# EAGLE design 002 (EAGLE 7.6.0)
MAPLE-CUx Large Version
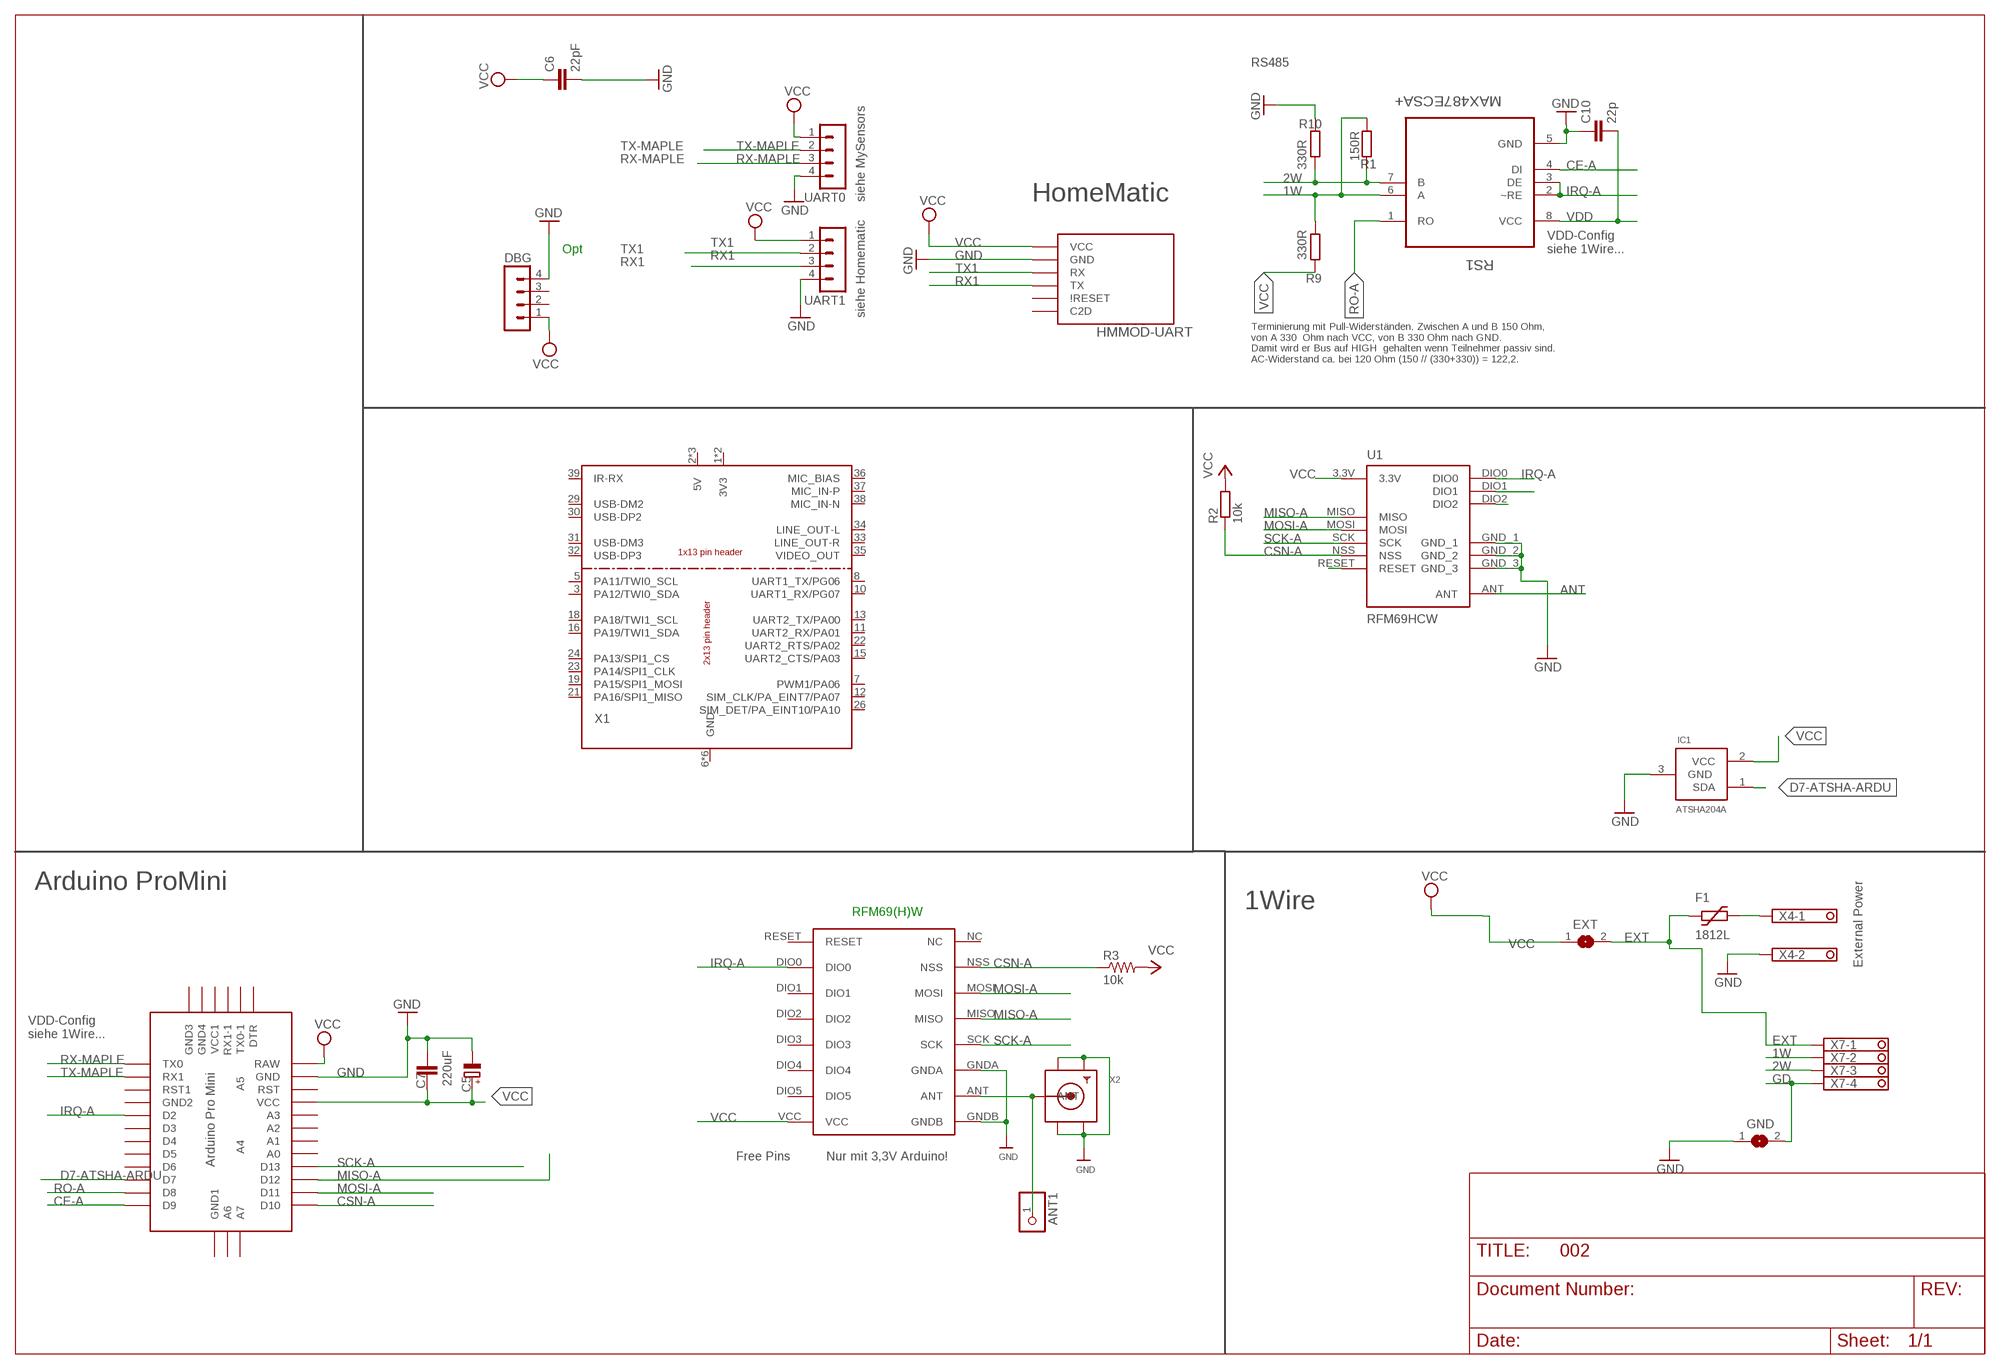
[diagram p0: schematic, sheet 1]

## Parts
ANT1  PINHD-1X1  [1X01]
C5  220uF  CPOL-EUE5-8.5  [E5-8,5]
C6  22pF  C-EUC0805  [C0805]
C7  C-EUC1812  [C1812]
C10  22p  C-EUC0805  [C0805]
DBG  MA04-1  [MA04-1]
EXT  SJ  [SJ]
F1  1812L  [1812L]
GND  SJ  [SJ]
HMMOD-UART  HM-MOD-UARTDIL  [HM-MOD-UART-DIL]
IC1  ATSHA204A  [SOT23]
R1  150R  R-EU_R0805  [R0805]
R2  10k  R-EU_M0805  [M0805]
R3  10k  RESISTOR0805-RES  [0805]
R9  330R  R-EU_R0805  [R0805]
R10  330R  R-EU_R0805  [R0805]
RFM69W  RFM69HW  [RFM]
RS1  MAX487ECSA+  [SOIC127P600X175-8N]
U1  RFM69HCW  [RFM69HCW-XXXS2]
U$2  ABK-PRO-MINI  [ABK-PRO-MINI]
UART0  MA04-1  [MA04-1]
UART1  MA04-1  [MA04-1]
X1  OPI-ZERO-XHAT  [OPI0HAT]
X2  SMACONNECTOR_EDGE  [SMA_EDGELAUNCH]
X4  1751248  [1751248]
X7  1751264  [1751264]

## Nets
1W: R1.1 R9.2 RS1.6(A) X7.2
2W: R1.2 R10.1 RS1.7(B) X7.3
ANT: ANT1.1 RFM69W.ANT U1.ANT X2.P(ANT)
CE-A: RS1.4(DI) U$2.D9
CSN-A: R2.1 R3.1 RFM69W.NSS U1.NSS U$2.D10
D7-ATSHA-ARDU: IC1.1(SDA) U$2.D7
EXT [PWR]: EXT.2 F1.P$1 X7.1
GD [PWR]: GND.2 X7.4
GND [PWR]: C5.- C6.2 C7.1 C10.1 DBG.4 GND.1 HMMOD-UART.2(GND) IC1.3(GND) R10.2 RFM69W.GNDA RFM69W.GNDB RS1.5(GND) U1.GND_1 U1.GND_2 U1.GND_3 U$2.GND UART0.4 UART1.4 X2.GND@1(GND4) X2.GND@2(GND3) X2.GND@3(GND2) X2.GND@4(GND1) X4.2
IRQ-A: RFM69W.DIO0 RS1.2(~RE) RS1.3(DE) U1.DIO0 U$2.D2
MISO-A: RFM69W.MISO U1.MISO U$2.D12
MOSI-A: RFM69W.MOSI U1.MOSI U$2.D11
N$2: U1.RESET
N$14: U1.DIO2
N$15: U1.DIO1
N$45 [PWR]: F1.P$2 X4.1
RO-A: RS1.1(RO) U$2.D8
RX1: HMMOD-UART.5(TX) UART1.3
RX-MAPLE: U$2.TX0 UART0.3
SCK-A: RFM69W.SCK U1.SCK U$2.D13
TX1: HMMOD-UART.6(RX) UART1.2
TX-MAPLE: U$2.RX1 UART0.2
VCC [PWR]: C5.+ C6.1 C7.2 DBG.1 EXT.1 HMMOD-UART.1(VCC) IC1.2(VCC) R2.2 R3.2 R9.1 RFM69W.VCC U1.3.3V U$2.RAW U$2.VCC UART0.1 UART1.1
VDD [PWR]: C10.2 RS1.8(VCC)
Unconnected: DBG.2 DBG.3 HMMOD-UART.3(C2D) HMMOD-UART.4(\!RESET) RFM69W.DIO1 RFM69W.DIO2 RFM69W.DIO3 RFM69W.DIO4 RFM69W.DIO5 RFM69W.NC RFM69W.RESET U$2.A0 U$2.A1 U$2.A2 U$2.A3 U$2.A4 U$2.A5 U$2.A6 U$2.A7 U$2.D3 U$2.D4 U$2.D5 U$2.D6 U$2.DTR U$2.GND1(GND2) U$2.GND2(GND3) U$2.GND3(GND4) U$2.GND4(GND1) U$2.RST U$2.RST1 U$2.RX1-1 U$2.TX0-1 U$2.VCC1 X1.3(PA12/TWI0_SDA) X1.5(PA11/TWI0_SCL) X1.7(PWM1/PA06) X1.8(UART1_TX/PG06) X1.10(UART1_RX/PG07) X1.11(UART2_RX/PA01) X1.12(SIM_CLK/PA_EINT7/PA07) X1.13(UART2_TX/PA00) X1.15(UART2_CTS/PA03) X1.16(PA19/TWI1_SDA) X1.18(PA18/TWI1_SCL) X1.19(PA15/SPI1_MOSI) X1.21(PA16/SPI1_MISO) X1.22(UART2_RTS/PA02) X1.23(PA14/SPI1_CLK) X1.24(PA13/SPI1_CS) X1.26(SIM_DET/PA_EINT10/PA10) X1.29(USB-DM2) X1.30(USB-DP2) X1.31(USB-DM3) X1.32(USB-DP3) X1.33(LINE_OUT-R) X1.34(LINE_OUT-L) X1.35(VIDEO_OUT) X1.36(MIC_BIAS) X1.37(MIC_IN-P) X1.38(MIC_IN-N) X1.39(IR-RX)

## Notes on the sheet
- RS485
- siehe MySensors | HomeMatic
- Opt
- VDD-Config
  siehe 1Wire...
- siehe Homematic
- Terminierung mit Pull-Widerständen. Zwischen A und B 150 Ohm,
  von A 330  Ohm nach VCC, von B 330 Ohm nach GND. 
  Damit wird er Bus auf HIGH  gehalten wenn Teilnehmer passiv sind.
  AC-Widerstand ca. bei 120 Ohm (150 // (330+330)) = 122,2.
- Arduino ProMini
- 1Wire
- RFM69(H)W
- External Power
- VDD-Config
  siehe 1Wire...
- Free Pins | Nur mit 3,3V Arduino!

## Power pins joined to a net without a drawn wire
3V3: X1.1(3V3) X1.17(3V3)
5V: X1.2(5V) X1.4(5V) X1.27(5V)
GND: X1.6(GND) X1.9(GND) X1.14(GND) X1.20(GND) X1.25(GND) X1.28(GND)

## Library data of the parts
ANT1 = pinhead:PINHD-1X1: PIN HEADER
C5 = rcl:CPOL-EU: POLARIZED CAPACITOR, European symbol
C6 C7 C10 = rcl:C-EU: CAPACITOR, European symbol
DBG UART0 UART1 = con-lstb:MA04-1: PIN HEADER; OC_FARNELL: unknown; OC_NEWARK: unknown
EXT GND = jumper:SJ: SMD solder JUMPER
F1 = ptc-littlefuse:1812L
HMMOD-UART = wireless:HM-MOD-UART: eQ3 HM-MOD-UART-AW-SH2 wireless module for 868 MHz. DIL version for mounting with pin header (antenna upwards) and SMD variant available (antenna downwards).
IC1 = Sensor:ATSHA204A
R1 R2 R9 R10 = rcl:R-EU_: RESISTOR, European symbol
R3 = doug:RESISTOR: Resistor Basic schematic elements and footprints for 0603, 1206, and PTH resistors.
RFM69W = hoperf:RFM69HW
RS1 = Maxim_By_element14_Batch_1:MAX487ECSA+: Low-Power, Slew-Rate-Limited RS-485/RS-422 Transceivers; MPN: MAX487ECSA+; OC_FARNELL: 9724532; OC_NEWARK: 68K4803; PACKAGE: SOIC-8; SUPPLIER: Maxim
U1 = doug:RFM69H
U$2 = Arduino-clone:ABK-PRO-MINI: ABK Pro-Mini Arduino Clone
X1 = OrangePi0:OPI-ZERO-X
X2 = adafruit:SMACONNECTOR: SMA Connector 90° DIP SMA Connector, 50 Ohm (4UConnector: 07259)
X4 = con-phoenix-350:1751248: MKDS 1/ 2-3,5 Printklemme Nennstrom: 10 A Bemessungsspannung: 160 V Raster: 3,5 mm Polzahl: 2 Montageart: Löten Anschlussart: Schraubanschluss Anschlussrichtung vom Leiter zur Platine: 0° Source: http://eshop.phoenixcontact.com .. 1751248.pdf; OC_FARNELL: unknown; OC_NEWARK: unknown
X7 = con-phoenix-350:1751264: MKDS 1/ 4-3,5 Printklemme Nennstrom: 10 A Bemessungsspannung: 160 V Raster: 3,5 mm Polzahl: 4 Montageart: Löten Anschlussart: Schraubanschluss Anschlussrichtung vom Leiter zur Platine: 0° Source: http://eshop.phoenixcontact.com .. 1751264.pdf; MPN: 1751264; OC_FARNELL: unknown; OC_NEWARK: 10R0934

## Net classes
0 default: width 0.305 mm
1 PWR: width 0.457 mm

## Board
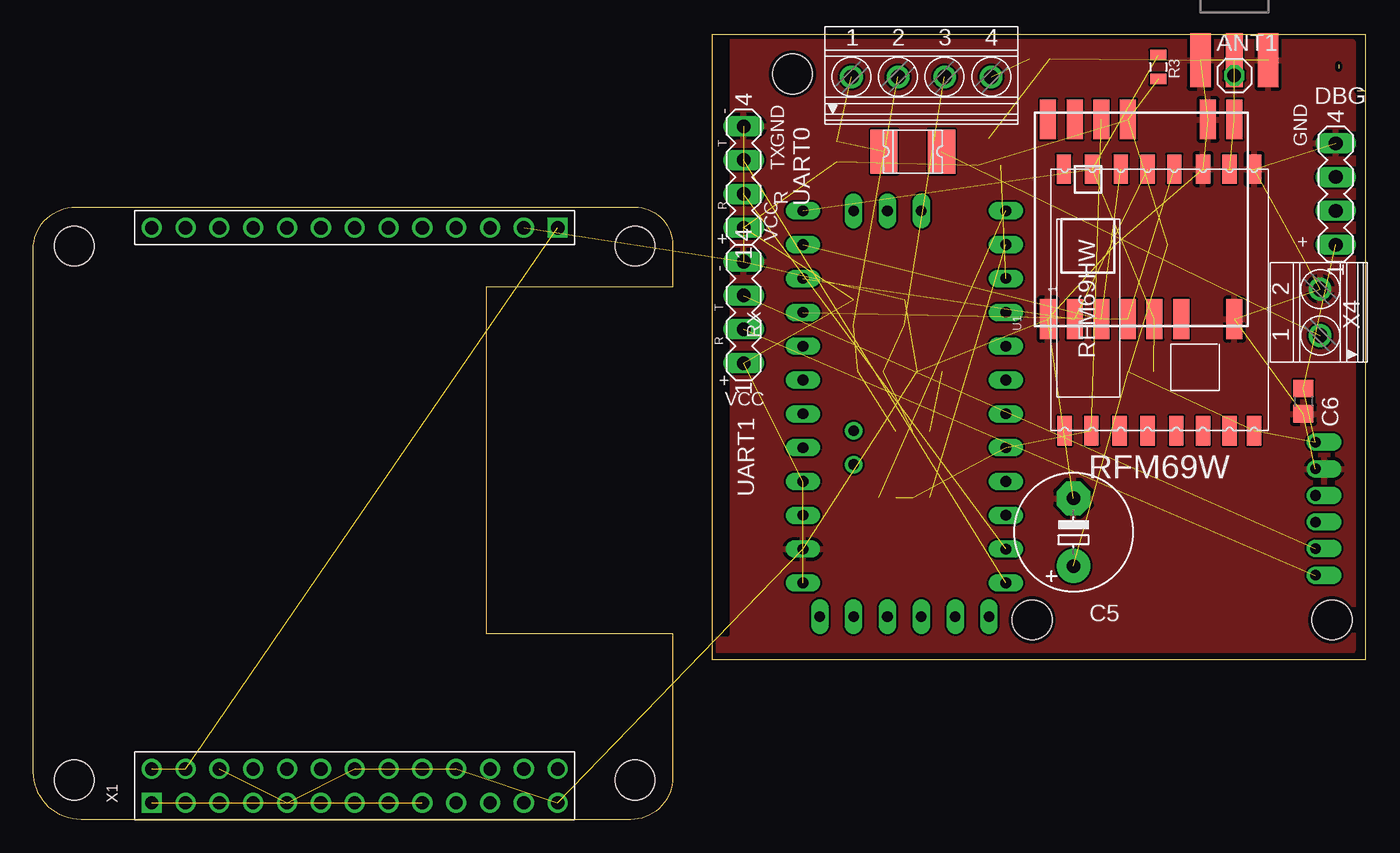
[diagram p1: board, top side]
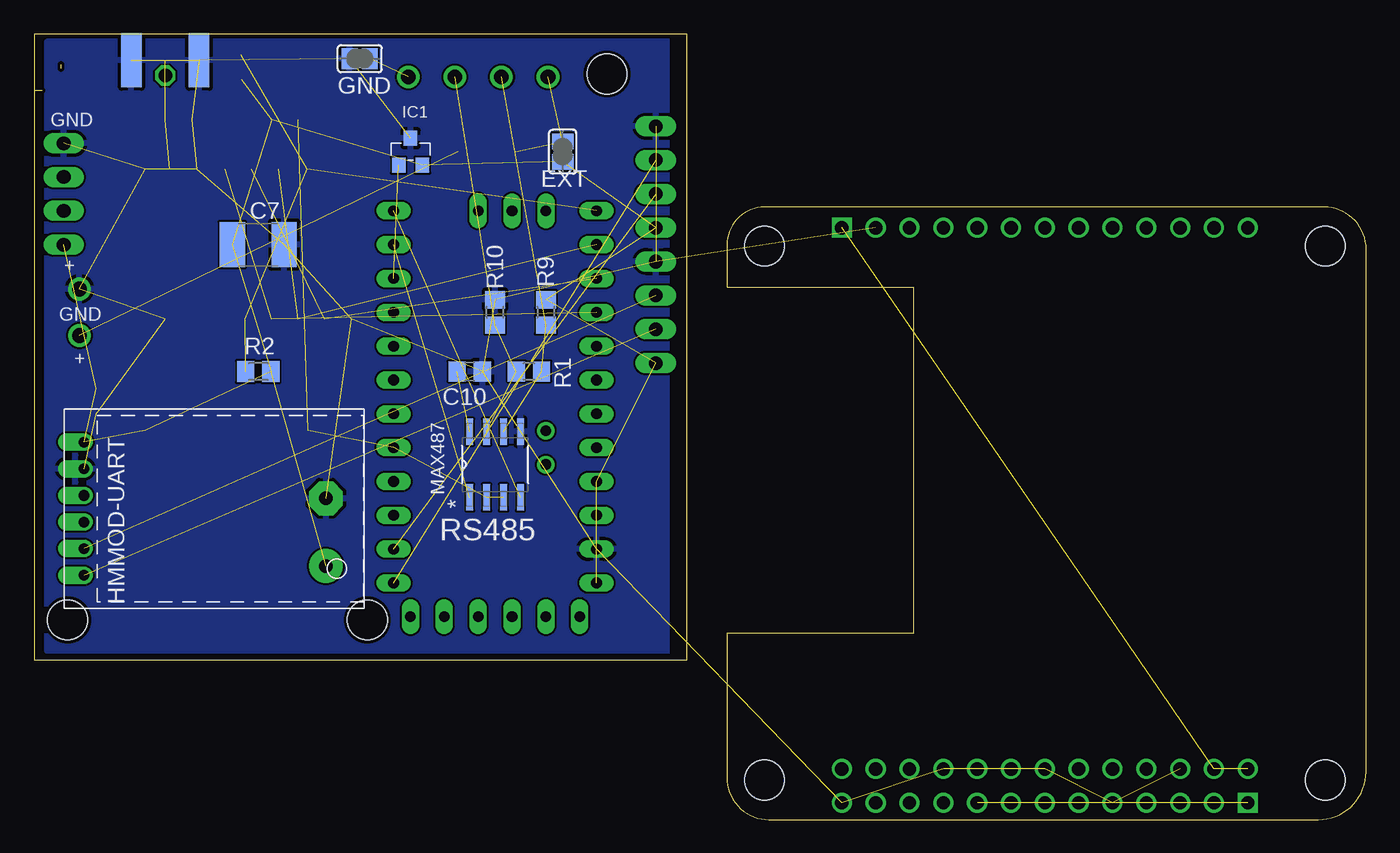
[diagram p2: board, bottom side, seen from below]

Size 100 x 59 mm. Coordinates in mm from the lower left corner, seen from the top.
Outline: 100,59 100,58.24
Outline: 98,56.7 98,56.41
Outline: 99.41,54.75 100,54.75
Outline: 100,59 51,59 51,12 100,12 100,54.75
Outline: 100,59 100,54.75
Outline: 44.84,0 3.61,0 arc-90 0,3.61 0,42.84 arc-90 3.16,46 45.17,46 arc-90 48,43.17 48,40 34,40 34,14 48,14 48,3.16 arc-90 44.84,0
Copper layers (1*16): Top 0.035mm / dielectric 1.5mm / Bottom 0.035mm
Design rules "SeeedStudio_2layer_DRU_no_angle_20140221": minimum track width 6mil, minimum drill 12mil, track to track 6mil, track to pad 6mil, pad to pad 6mil, via to via 6mil, smd to smd 0mil, copper to edge 10mil, drill to drill 10mil, minimum pad ring 10mil, minimum via ring 6mil, stop-mask expansion 2mil, vias tented up to drill 100mil, thermal gap 10mil
Holes 3 mm at 57,56 75,15 97.5,15
tRestrict: area 51.4,14 to 52.1,59.1
bRestrict: area 51.4,12.7 to 52.1,58.4

### Footprints (pad centres in the part's own frame; a part is rotated, then mirrored left to right if it is on the bottom)
1X01 = drill 1.016 octagon: 1 0,0
E5-8,5 = drill 1.016 pad 2.54: + -2.54,0 | drill 1.016 pad 2.54 octagon: - 2.54,0
C0805 = smd 1.3 x 1.5: 1 -0.95,0; 2 0.95,0
C1812 = smd 1.9 x 3.4: 1 -1.95,0; 2 1.95,0
MA04-1 = drill 1.016 long: 1 -3.81,0; 2 -1.27,0; 3 1.27,0; 4 3.81,0
SJ = smd 1.168 x 1.6: 1 -0.762,0; 2 0.762,0
1812L = smd 2.03 x 3.3: P$1 -2.16,0; P$2 2.16,0
HM-MOD-UART-DIL = drill 0.8 offset: 1 0,12; 2 0,10; 3 0,8; 4 0,6; 5 0,4; 6 0,2
SOT23 = smd 1.016 x 1.143: 1 -0.889,-1.016; 2 0.889,-1.016; 3 0,1.016
R0805 = smd 1.3 x 1.5: 1 -0.95,0; 2 0.95,0
M0805 = smd 1.3 x 1.6: 1 -0.95,0; 2 0.95,0
0805 = smd 0.8 x 1.2: 1 -0.9,0; 2 0.9,0
RFM = smd 2.184 x 1.067: ANT 19.651,2.889; DIO0 0,13.27; DIO1 0,11.143; DIO2 0,9.047; DIO3 0,6.889; DIO4 0,4.889; DIO5 0,2.889; GNDA 19.651,4.889; GNDB 19.651,1.048; MISO 19.651,9.047; MOSI 19.651,11.047; NC 19.651,15.334; NSS 19.651,13.206; RESET 0,15.27; SCK 19.651,7.048; VCC 0,1.048
SOIC127P600X175-8N = smd 1.981 x 0.533: 1 -2.464,1.905; 2 -2.464,0.635; 3 -2.464,-0.635; 4 -2.464,-1.905; 5 2.464,-1.905; 6 2.464,-0.635; 7 2.464,0.635; 8 2.464,1.905
RFM69HCW-XXXS2 = smd 3 x 1.2: 3.3V 7.5,1; ANT 7.5,-7; DIO0 7.5,3; DIO1 7.5,5; DIO2 7.5,7; GND_1 7.5,-5; GND_2 -7.5,-7; GND_3 -7.5,7; MISO -7.5,5; MOSI -7.5,3; NSS -7.5,-1; RESET -7.5,-3; SCK -7.5,1
ABK-PRO-MINI = drill 0.8 long: A0 10.16,-3.81; A1 10.16,-6.35; A2 10.16,-8.89; A3 10.16,-11.43; A6 3.81,-21.59; A7 6.35,-21.59; D2 -5.08,-3.81; D3 -5.08,-6.35; D4 -5.08,-8.89; D5 -5.08,-11.43; D6 -5.08,-13.97; D7 -5.08,-16.51; D8 -5.08,-19.05; D9 -5.08,-21.59; D10 10.16,-21.59; D11 10.16,-19.05; D12 10.16,-16.51; D13 10.16,-13.97; DTR 8.89,8.89; GND 10.16,3.81; GND1 -5.08,-1.27; GND2 -3.81,8.89; GND3 -1.27,8.89; GND4 1.27,-21.59; RAW 10.16,6.35; RST 10.16,1.27; RST1 -5.08,1.27; RX1 -5.08,3.81; RX1-1 3.81,8.89; TX0 -5.08,6.35; TX0-1 6.35,8.89; VCC 10.16,-1.27; VCC1 1.27,8.89 | drill 0.8: A4 6.35,-5.08; A5 6.35,-2.54
OPI0HAT = drill 1 square: 1 0,0; 27 30.48,43.18 | drill 1: 2 0,2.54; 3 2.54,0; 4 2.54,2.54; 5 5.08,0; 6 5.08,2.54; 7 7.62,0; 8 7.62,2.54; 9 10.16,0; 10 10.16,2.54; 11 12.7,0; 12 12.7,2.54; 13 15.24,0; 14 15.24,2.54; 15 17.78,0; 16 17.78,2.54; 17 20.32,0; 18 20.32,2.54; 19 22.86,0; 20 22.86,2.54; 21 25.4,0; 22 25.4,2.54; 23 27.94,0; 24 27.94,2.54; 25 30.48,0; 26 30.48,2.54; 28 27.94,43.18; 29 25.4,43.18; 30 22.86,43.18; 31 20.32,43.18; 32 17.78,43.18; 33 15.24,43.18; 34 12.7,43.18; 35 10.16,43.18; 36 7.62,43.18; 37 5.08,43.18; 38 2.54,43.18; 39 0,43.18 | hole 3: -5.815,1.694; 36.295,1.694; 36.295,41.805; -5.815,41.805
SMA_EDGELAUNCH = smd 4.064 x 1.524: GND@1 2.032,-2.54; GND@2 2.032,2.54 | smd 4.064 x 1.524 bottom: GND@3 2.032,2.54; GND@4 2.032,-2.54 | smd 4.064 x 1.27: P 2.032,0
1751248 = drill 1.1 pad 1.7: 1 -1.75,-0.1; 2 1.75,-0.1
1751264 = drill 1.1 pad 1.7: 1 -5.25,-0.1; 2 -1.75,-0.1; 3 1.75,-0.1; 4 5.25,-0.1

### Placement (x,y rotation side)
ANT1  90.17,55.88 0 top
C5  78.11,21.59 90 top
C6  95.36,31.43 270 top
C7  83.19,43.18 180 bottom
C10  67.31,33.66 180 bottom
DBG  97.79,46.99 90 top
EXT  60.33,50.16 90 bottom
F1  66.04,50.16 0 top
GND  75.56,57.15 0 bottom
HMMOD-UART  96.27,16.35 0 bottom
IC1  71.75,50.16 0 bottom
R1  62.87,33.66 180 bottom
R2  83.19,33.66 0 bottom
R3  84.45,56.52 270 top
R9  61.59,38.1 270 bottom
R10  65.41,38.1 90 bottom
RFM69W  92.71,29.21 90 top
RS1  65.41,26.67 90 bottom
U1  83.19,45.09 90 top
U$2  67.94,24.13 180 top
UART0  53.34,48.26 90 top
UART1  53.34,38.1 90 top
X1  8.89,1.27 0 top
X2  90.17,59.05 270 top
X4  96.52,38.1 90 top
X7  66.67,55.88 0 top

### Tracks (layer width: path | path; a pad name or v marks a point on that pad's centre or on a via)
1W  (3 unrouted)
2W  (3 unrouted)
3V3  (1 unrouted)
5V  (2 unrouted)
ANT  (3 unrouted)
CE-A  (1 unrouted)
CSN-A  (4 unrouted)
D7-ATSHA-ARDU  (1 unrouted)
EXT  (2 unrouted)
GD  (1 unrouted)
GND  (28 unrouted)
  pour Top: 51.44,12.7 51.44,58.42 99.06,58.42 99.06,12.7
  pour Bottom: 51.44,12.7 51.44,58.42 99.06,58.42 99.06,12.7
IRQ-A  (4 unrouted)
MISO-A  (2 unrouted)
MOSI-A  (2 unrouted)
N$45  (1 unrouted)
RO-A  (1 unrouted)
RX1  (1 unrouted)
RX-MAPLE  (1 unrouted)
SCK-A  (2 unrouted)
TX1  (1 unrouted)
TX-MAPLE  (1 unrouted)
VCC  (15 unrouted)
VDD  (1 unrouted)

### Text on the board
tNames: GND | - | T | GND | TX | R | R | + | VCC | + | - | T | R | RX | + | VCC
bNames: GND | + | GND | + | MAX487 | RS485